# EAGLE schematic BusBoard (EAGLE 7.3.0)
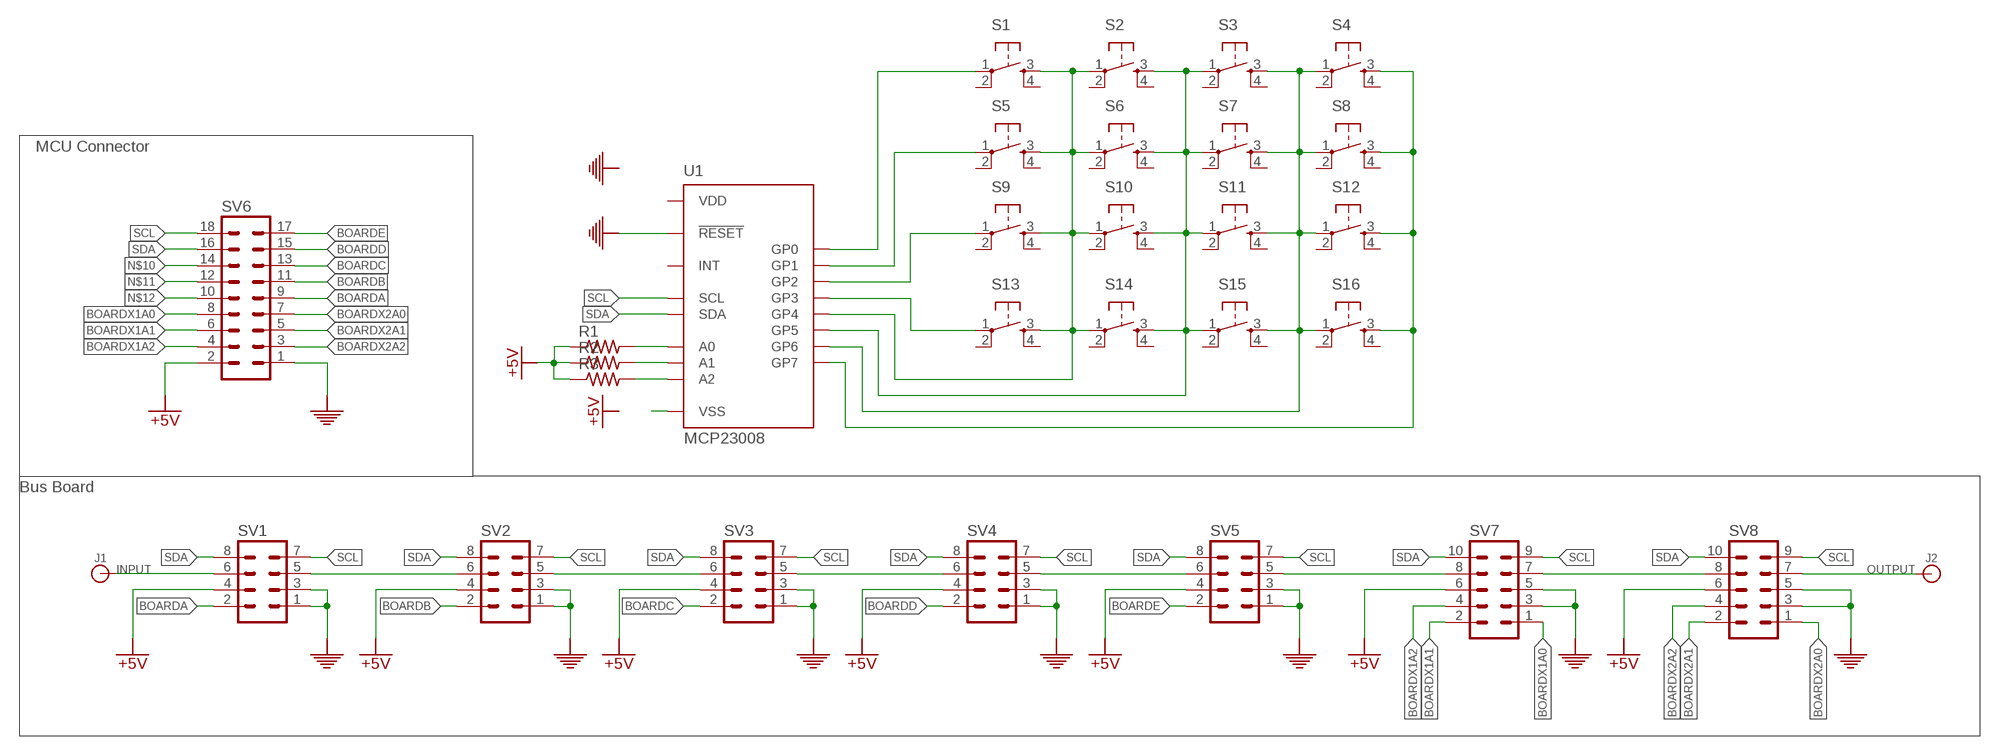
[diagram p0: schematic, sheet 1]

## Parts
J1  BANANA_CONN  [BANANA_CONN]
J2  BANANA_CONN  [BANANA_CONN]
R1  R-US_M0805  [M0805]
R2  R-US_M0805  [M0805]
R3  R-US_M0805  [M0805]
S1  TAC_SWITCHPTH  [TACTILE-PTH]
S2  TAC_SWITCHPTH  [TACTILE-PTH]
S3  TAC_SWITCHPTH  [TACTILE-PTH]
S4  TAC_SWITCHPTH  [TACTILE-PTH]
S5  TAC_SWITCHPTH  [TACTILE-PTH]
S6  TAC_SWITCHPTH  [TACTILE-PTH]
S7  TAC_SWITCHPTH  [TACTILE-PTH]
S8  TAC_SWITCHPTH  [TACTILE-PTH]
S9  TAC_SWITCHPTH  [TACTILE-PTH]
S10  TAC_SWITCHPTH  [TACTILE-PTH]
S11  TAC_SWITCHPTH  [TACTILE-PTH]
S12  TAC_SWITCHPTH  [TACTILE-PTH]
S13  TAC_SWITCHPTH  [TACTILE-PTH]
S14  TAC_SWITCHPTH  [TACTILE-PTH]
S15  TAC_SWITCHPTH  [TACTILE-PTH]
S16  TAC_SWITCHPTH  [TACTILE-PTH]
SV1  MA04-2  [MA04-2]
SV2  MA04-2  [MA04-2]
SV3  MA04-2  [MA04-2]
SV4  MA04-2  [MA04-2]
SV5  MA04-2  [MA04-2]
SV6  MA09-2  [MA09-2]
SV7  MA05-2  [MA05-2]
SV8  MA05-2  [MA05-2]
U1  MCP23008  [SOIC]

## Nets
+5V: R1.1 R2.1 R3.1 SV1.4 SV2.4 SV3.4 SV4.4 SV5.4 SV6.2 SV7.6 SV8.6
BOARDA: SV1.2 SV6.9
BOARDB: SV2.2 SV6.11
BOARDC: SV3.2 SV6.13
BOARDD: SV4.2 SV6.15
BOARDE: SV5.2 SV6.17
BOARDX1A0: SV6.8 SV7.1
BOARDX1A1: SV6.6 SV7.2
BOARDX1A2: SV6.4 SV7.4
BOARDX2A0: SV6.7 SV8.1
BOARDX2A1: SV6.5 SV8.2
BOARDX2A2: SV6.3 SV8.4
GND: SV1.1 SV1.3 SV2.1 SV2.3 SV3.1 SV3.3 SV4.1 SV4.3 SV5.1 SV5.3 SV6.1 SV7.3 SV7.5 SV8.3 SV8.5 U1.P$6(!RESET)
INPUT: J1.P$1 SV1.6
N$1: S3.3 S4.1 S7.3 S8.1 S11.3 S12.1 S15.3 S16.1 U1.P$16(GP6)
N$3: S1.1 U1.P$10(GP0)
N$4: S5.1 U1.P$11(GP1)
N$5: S9.1 U1.P$12(GP2)
N$6: S13.1 U1.P$13(GP3)
N$7: S1.3 S2.1 S5.3 S6.1 S9.3 S10.1 S13.3 S14.1 U1.P$14(GP4)
N$8: S2.3 S3.1 S6.3 S7.1 S10.3 S11.1 S14.3 S15.1 U1.P$15(GP5)
N$10: SV6.14
N$11: SV6.12
N$12: SV6.10
N$13: S4.3 S8.3 S12.3 S16.3 U1.P$17(GP7)
N$14: U1.P$9(VSS)
N$15: R3.2 U1.P$3(A2)
N$16: R2.2 U1.P$4(A1)
N$17: R1.2 U1.P$5(A0)
OUTPUT: J2.P$1 SV8.7
OUTPUT1: SV2.5 SV3.6
OUTPUT2: SV3.5 SV4.6
OUTPUT3: SV4.5 SV5.6
OUTPUT4: SV5.5 SV7.8
OUTPUT5: SV7.7 SV8.8
OUTPUTSUB: SV1.5 SV2.6
SCL: SV1.7 SV2.7 SV3.7 SV4.7 SV5.7 SV6.18 SV7.9 SV8.9 U1.P$1(SCL)
SDA: SV1.8 SV2.8 SV3.8 SV4.8 SV5.8 SV6.16 SV7.10 SV8.10 U1.P$2(SDA)
Unconnected: S1.2 S1.4 S2.2 S2.4 S3.2 S3.4 S4.2 S4.4 S5.2 S5.4 S6.2 S6.4 S7.2 S7.4 S8.2 S8.4 S9.2 S9.4 S10.2 S10.4 S11.2 S11.4 S12.2 S12.4 S13.2 S13.4 S14.2 S14.4 S15.2 S15.4 S16.2 S16.4 U1.P$8(INT)

## Notes on the sheet
- MCU Connector
- Bus Board

## Power pins joined to a net without a drawn wire
VDD: U1.P$18(VDD)

## Library data of the parts
J1 J2 = SparkFun:BANANA_CONN
R1-R3 = resistor:R-US_: RESISTOR, American symbol
S1-S16 = SparkFun:TAC_SWITCH: Momentary Switch Button commonly used for reset or general input. Spark Fun Electronics SKU : COM-00097
SV1-SV5 = con-lstb:MA04-2: PIN HEADER; OC_FARNELL: unknown; OC_NEWARK: unknown
SV6 = con-lstb:MA09-2: PIN HEADER; OC_FARNELL: unknown; OC_NEWARK: unknown
SV7 SV8 = con-lstb:MA05-2: PIN HEADER; OC_FARNELL: unknown; OC_NEWARK: unknown
U1 = Jeremy:MCP23008: MCP23008 8-Bit I/O Expander I2C Interface ADDR: S0100XXX